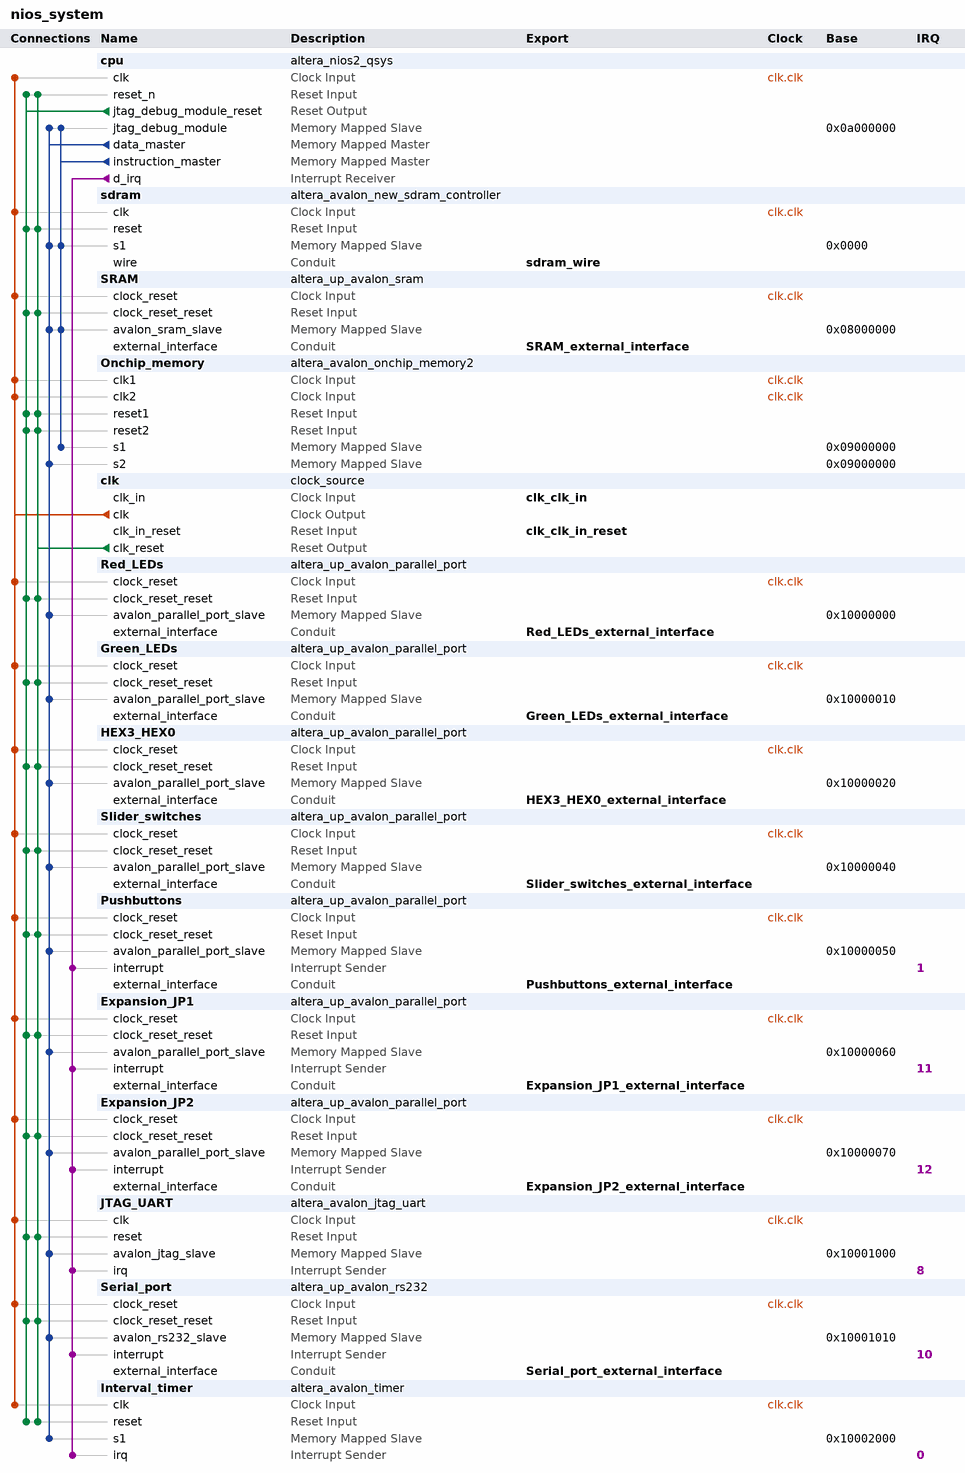
[diagram p0: system contents]
# Platform Designer (Qsys) system nios_system, Cyclone II EP2C20F484C7
# Parameters at their usual value, and those the tool derives, are not listed.
package require -exact qsys 12.0
create_system nios_system
set_project_property DEVICE_FAMILY {Cyclone II}
set_project_property DEVICE EP2C20F484C7

add_instance cpu altera_nios2_qsys 13.0
set_instance_parameter_value cpu manuallyAssignCpuID false
set_instance_parameter_value cpu resetSlave sdram.s1
set_instance_parameter_value cpu exceptionSlave sdram.s1
set_instance_parameter_value cpu breakSlave cpu.jtag_debug_module
set_instance_parameter_value cpu mmu_processIDNumBits 10
set_instance_parameter_value cpu impl Tiny
set_instance_parameter_value cpu icache_size 4096
set_instance_parameter_value cpu dcache_lineSize 4

add_instance sdram altera_avalon_new_sdram_controller 13.0.1
set_instance_parameter_value sdram TAC 5.5
set_instance_parameter_value sdram TRCD 20.0
set_instance_parameter_value sdram TRP 20.0
set_instance_parameter_value sdram casLatency 3
set_instance_parameter_value sdram columnWidth 8
set_instance_parameter_value sdram dataWidth 16
set_instance_parameter_value sdram generateSimulationModel false
set_instance_parameter_value sdram model custom
set_instance_parameter_value sdram numberOfBanks 4
set_instance_parameter_value sdram numberOfChipSelects 1
set_instance_parameter_value sdram powerUpDelay 100.0
set_instance_parameter_value sdram refreshPeriod 15.625
set_instance_parameter_value sdram rowWidth 12

add_instance SRAM altera_up_avalon_sram 12.0
set_instance_parameter_value SRAM board DE1
set_instance_parameter_value SRAM pixel_buffer false

add_instance Onchip_memory altera_avalon_onchip_memory2 13.0.1
set_instance_parameter_value Onchip_memory blockType M4K
set_instance_parameter_value Onchip_memory dataWidth 32
set_instance_parameter_value Onchip_memory dualPort true
set_instance_parameter_value Onchip_memory initMemContent true
set_instance_parameter_value Onchip_memory initializationFileName Onchip_memory
set_instance_parameter_value Onchip_memory memorySize 8192

add_instance clk clock_source 13.0
set_instance_parameter_value clk clockFrequency 50000000

add_instance Red_LEDs altera_up_avalon_parallel_port 12.0
set_instance_parameter_value Red_LEDs board DE1
set_instance_parameter_value Red_LEDs preset LEDs
set_instance_parameter_value Red_LEDs leds Red
set_instance_parameter_value Red_LEDs capture false
set_instance_parameter_value Red_LEDs edge Rising
set_instance_parameter_value Red_LEDs irq false

add_instance Green_LEDs altera_up_avalon_parallel_port 12.0
set_instance_parameter_value Green_LEDs board DE1
set_instance_parameter_value Green_LEDs preset LEDs
set_instance_parameter_value Green_LEDs capture false
set_instance_parameter_value Green_LEDs edge Rising
set_instance_parameter_value Green_LEDs irq false

add_instance HEX3_HEX0 altera_up_avalon_parallel_port 12.0
set_instance_parameter_value HEX3_HEX0 board DE1
set_instance_parameter_value HEX3_HEX0 preset {Seven Segment Displays}
set_instance_parameter_value HEX3_HEX0 capture false
set_instance_parameter_value HEX3_HEX0 edge Rising
set_instance_parameter_value HEX3_HEX0 irq false

add_instance Slider_switches altera_up_avalon_parallel_port 12.0
set_instance_parameter_value Slider_switches board DE1
set_instance_parameter_value Slider_switches preset {Slider Switches}
set_instance_parameter_value Slider_switches capture false
set_instance_parameter_value Slider_switches edge Rising
set_instance_parameter_value Slider_switches irq false

add_instance Pushbuttons altera_up_avalon_parallel_port 12.0
set_instance_parameter_value Pushbuttons board DE1
set_instance_parameter_value Pushbuttons preset Pushbuttons
set_instance_parameter_value Pushbuttons capture true
set_instance_parameter_value Pushbuttons edge Falling
set_instance_parameter_value Pushbuttons irq true

add_instance Expansion_JP1 altera_up_avalon_parallel_port 12.0
set_instance_parameter_value Expansion_JP1 board DE1
set_instance_parameter_value Expansion_JP1 preset {Expansion Header}
set_instance_parameter_value Expansion_JP1 capture true
set_instance_parameter_value Expansion_JP1 edge Falling
set_instance_parameter_value Expansion_JP1 irq true

add_instance Expansion_JP2 altera_up_avalon_parallel_port 12.0
set_instance_parameter_value Expansion_JP2 board DE1
set_instance_parameter_value Expansion_JP2 preset {Expansion Header}
set_instance_parameter_value Expansion_JP2 gpio {GPIO 1 (JP2)}
set_instance_parameter_value Expansion_JP2 capture true
set_instance_parameter_value Expansion_JP2 edge Falling
set_instance_parameter_value Expansion_JP2 irq true

add_instance JTAG_UART altera_avalon_jtag_uart 13.0.1
set_instance_parameter_value JTAG_UART simInteractiveOptions INTERACTIVE_ASCII_OUTPUT

add_instance Serial_port altera_up_avalon_rs232 12.0
set_instance_parameter_value Serial_port baud 115200
set_instance_parameter_value Serial_port parity Odd

add_instance Interval_timer altera_avalon_timer 13.0.1
set_instance_parameter_value Interval_timer period 125.0
set_instance_parameter_value Interval_timer periodUnits MSEC

# connections
add_connection clk.clk cpu.clk clock
add_connection clk.clk Expansion_JP1.clock_reset clock
add_connection clk.clk Expansion_JP2.clock_reset clock
add_connection clk.clk Green_LEDs.clock_reset clock
add_connection clk.clk HEX3_HEX0.clock_reset clock
add_connection clk.clk Interval_timer.clk clock
add_connection clk.clk JTAG_UART.clk clock
add_connection clk.clk Onchip_memory.clk1 clock
add_connection clk.clk Onchip_memory.clk2 clock
add_connection clk.clk Pushbuttons.clock_reset clock
add_connection clk.clk Red_LEDs.clock_reset clock
add_connection clk.clk sdram.clk clock
add_connection clk.clk Serial_port.clock_reset clock
add_connection clk.clk Slider_switches.clock_reset clock
add_connection clk.clk SRAM.clock_reset clock
add_connection clk.clk_reset cpu.reset_n reset
add_connection clk.clk_reset Expansion_JP1.clock_reset_reset reset
add_connection clk.clk_reset Expansion_JP2.clock_reset_reset reset
add_connection clk.clk_reset Green_LEDs.clock_reset_reset reset
add_connection clk.clk_reset HEX3_HEX0.clock_reset_reset reset
add_connection clk.clk_reset Interval_timer.reset reset
add_connection clk.clk_reset JTAG_UART.reset reset
add_connection clk.clk_reset Onchip_memory.reset1 reset
add_connection clk.clk_reset Onchip_memory.reset2 reset
add_connection clk.clk_reset Pushbuttons.clock_reset_reset reset
add_connection clk.clk_reset Red_LEDs.clock_reset_reset reset
add_connection clk.clk_reset sdram.reset reset
add_connection clk.clk_reset Serial_port.clock_reset_reset reset
add_connection clk.clk_reset Slider_switches.clock_reset_reset reset
add_connection clk.clk_reset SRAM.clock_reset_reset reset
add_connection cpu.jtag_debug_module_reset cpu.reset_n reset
add_connection cpu.jtag_debug_module_reset Expansion_JP1.clock_reset_reset reset
add_connection cpu.jtag_debug_module_reset Expansion_JP2.clock_reset_reset reset
add_connection cpu.jtag_debug_module_reset Green_LEDs.clock_reset_reset reset
add_connection cpu.jtag_debug_module_reset HEX3_HEX0.clock_reset_reset reset
add_connection cpu.jtag_debug_module_reset Interval_timer.reset reset
add_connection cpu.jtag_debug_module_reset JTAG_UART.reset reset
add_connection cpu.jtag_debug_module_reset Onchip_memory.reset1 reset
add_connection cpu.jtag_debug_module_reset Onchip_memory.reset2 reset
add_connection cpu.jtag_debug_module_reset Pushbuttons.clock_reset_reset reset
add_connection cpu.jtag_debug_module_reset Red_LEDs.clock_reset_reset reset
add_connection cpu.jtag_debug_module_reset sdram.reset reset
add_connection cpu.jtag_debug_module_reset Serial_port.clock_reset_reset reset
add_connection cpu.jtag_debug_module_reset Slider_switches.clock_reset_reset reset
add_connection cpu.jtag_debug_module_reset SRAM.clock_reset_reset reset
add_connection cpu.data_master cpu.jtag_debug_module avalon
set_connection_parameter_value cpu.data_master/cpu.jtag_debug_module baseAddress 0x0a000000
add_connection cpu.data_master Expansion_JP1.avalon_parallel_port_slave avalon
set_connection_parameter_value cpu.data_master/Expansion_JP1.avalon_parallel_port_slave baseAddress 0x10000060
add_connection cpu.data_master Expansion_JP2.avalon_parallel_port_slave avalon
set_connection_parameter_value cpu.data_master/Expansion_JP2.avalon_parallel_port_slave baseAddress 0x10000070
add_connection cpu.data_master Green_LEDs.avalon_parallel_port_slave avalon
set_connection_parameter_value cpu.data_master/Green_LEDs.avalon_parallel_port_slave baseAddress 0x10000010
add_connection cpu.data_master HEX3_HEX0.avalon_parallel_port_slave avalon
set_connection_parameter_value cpu.data_master/HEX3_HEX0.avalon_parallel_port_slave baseAddress 0x10000020
add_connection cpu.data_master Interval_timer.s1 avalon
set_connection_parameter_value cpu.data_master/Interval_timer.s1 baseAddress 0x10002000
add_connection cpu.data_master JTAG_UART.avalon_jtag_slave avalon
set_connection_parameter_value cpu.data_master/JTAG_UART.avalon_jtag_slave baseAddress 0x10001000
add_connection cpu.data_master Onchip_memory.s2 avalon
set_connection_parameter_value cpu.data_master/Onchip_memory.s2 baseAddress 0x09000000
add_connection cpu.data_master Pushbuttons.avalon_parallel_port_slave avalon
set_connection_parameter_value cpu.data_master/Pushbuttons.avalon_parallel_port_slave baseAddress 0x10000050
add_connection cpu.data_master Red_LEDs.avalon_parallel_port_slave avalon
set_connection_parameter_value cpu.data_master/Red_LEDs.avalon_parallel_port_slave baseAddress 0x10000000
add_connection cpu.data_master sdram.s1 avalon
set_connection_parameter_value cpu.data_master/sdram.s1 baseAddress 0x0000
add_connection cpu.data_master Serial_port.avalon_rs232_slave avalon
set_connection_parameter_value cpu.data_master/Serial_port.avalon_rs232_slave baseAddress 0x10001010
add_connection cpu.data_master Slider_switches.avalon_parallel_port_slave avalon
set_connection_parameter_value cpu.data_master/Slider_switches.avalon_parallel_port_slave baseAddress 0x10000040
add_connection cpu.data_master SRAM.avalon_sram_slave avalon
set_connection_parameter_value cpu.data_master/SRAM.avalon_sram_slave baseAddress 0x08000000
add_connection cpu.instruction_master cpu.jtag_debug_module avalon
set_connection_parameter_value cpu.instruction_master/cpu.jtag_debug_module baseAddress 0x0a000000
add_connection cpu.instruction_master Onchip_memory.s1 avalon
set_connection_parameter_value cpu.instruction_master/Onchip_memory.s1 baseAddress 0x09000000
add_connection cpu.instruction_master sdram.s1 avalon
set_connection_parameter_value cpu.instruction_master/sdram.s1 baseAddress 0x0000
add_connection cpu.instruction_master SRAM.avalon_sram_slave avalon
set_connection_parameter_value cpu.instruction_master/SRAM.avalon_sram_slave baseAddress 0x08000000
add_connection cpu.d_irq Expansion_JP1.interrupt interrupt
set_connection_parameter_value cpu.d_irq/Expansion_JP1.interrupt irqNumber 11
add_connection cpu.d_irq Expansion_JP2.interrupt interrupt
set_connection_parameter_value cpu.d_irq/Expansion_JP2.interrupt irqNumber 12
add_connection cpu.d_irq Interval_timer.irq interrupt
set_connection_parameter_value cpu.d_irq/Interval_timer.irq irqNumber 0
add_connection cpu.d_irq JTAG_UART.irq interrupt
set_connection_parameter_value cpu.d_irq/JTAG_UART.irq irqNumber 8
add_connection cpu.d_irq Pushbuttons.interrupt interrupt
set_connection_parameter_value cpu.d_irq/Pushbuttons.interrupt irqNumber 1
add_connection cpu.d_irq Serial_port.interrupt interrupt
set_connection_parameter_value cpu.d_irq/Serial_port.interrupt irqNumber 10

# exported interfaces
add_interface SRAM_external_interface conduit end
set_interface_property SRAM_external_interface EXPORT_OF SRAM.external_interface
add_interface clk_clk_in_reset reset sink
set_interface_property clk_clk_in_reset EXPORT_OF clk.clk_in_reset
add_interface Expansion_JP1_external_interface conduit end
set_interface_property Expansion_JP1_external_interface EXPORT_OF Expansion_JP1.external_interface
add_interface Green_LEDs_external_interface conduit end
set_interface_property Green_LEDs_external_interface EXPORT_OF Green_LEDs.external_interface
add_interface sdram_wire conduit end
set_interface_property sdram_wire EXPORT_OF sdram.wire
add_interface Expansion_JP2_external_interface conduit end
set_interface_property Expansion_JP2_external_interface EXPORT_OF Expansion_JP2.external_interface
add_interface Serial_port_external_interface conduit end
set_interface_property Serial_port_external_interface EXPORT_OF Serial_port.external_interface
add_interface clk_clk_in clock sink
set_interface_property clk_clk_in EXPORT_OF clk.clk_in
add_interface Pushbuttons_external_interface conduit end
set_interface_property Pushbuttons_external_interface EXPORT_OF Pushbuttons.external_interface
add_interface Slider_switches_external_interface conduit end
set_interface_property Slider_switches_external_interface EXPORT_OF Slider_switches.external_interface
add_interface Red_LEDs_external_interface conduit end
set_interface_property Red_LEDs_external_interface EXPORT_OF Red_LEDs.external_interface
add_interface HEX3_HEX0_external_interface conduit end
set_interface_property HEX3_HEX0_external_interface EXPORT_OF HEX3_HEX0.external_interface

set_interconnect_requirement {$system} qsys_mm.clockCrossingAdapter HANDSHAKE
set_interconnect_requirement {$system} qsys_mm.maxAdditionalLatency 0

save_system nios_system.qsys
